# Altium schematic sheet PSU.SchDoc
size A4; Organization: Altium Limited; Address1: L3, 12a Rodborough Rd; Address2: Frenchs Forest; Address3: NSW; Address4: Australia 2086
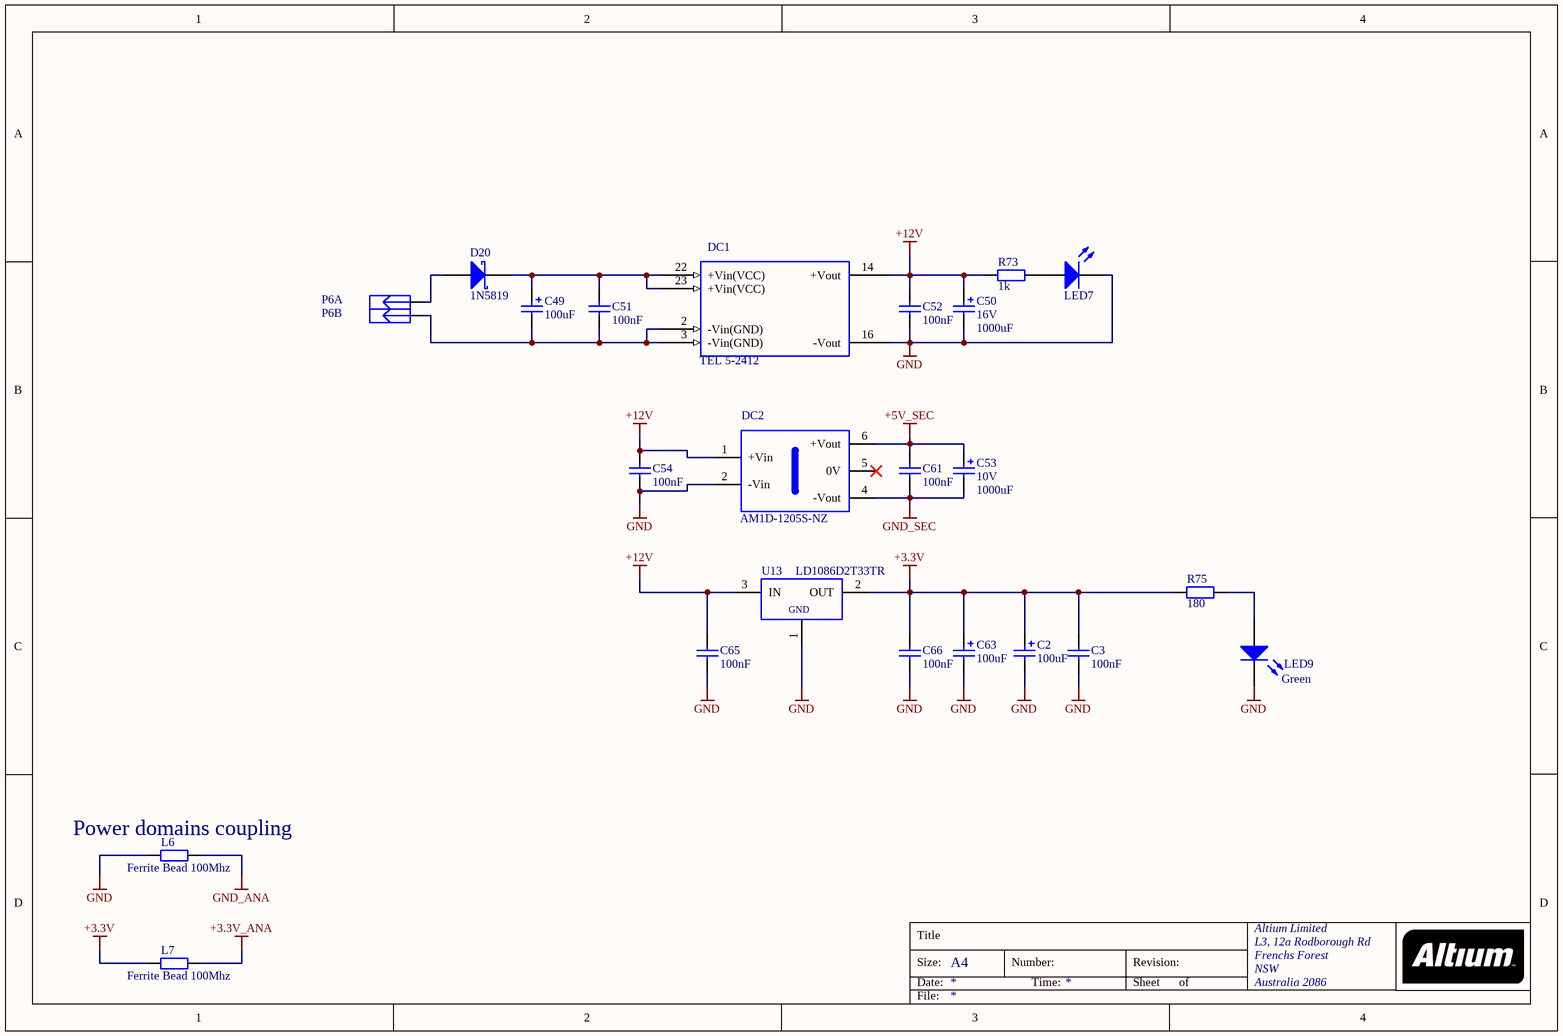
[diagram p0: PSU.SchDoc]

## Parts
C2  value 100uF  [CAPPR3.5-8x12]  (hidden comment: Cap)
C3  value 100nF  [1206_REFLOW]  (hidden comment: Cap 1206)
C49  value 100uF  [CAPPR3.5-8x12]  (hidden comment: Cap)
C50  value 1000uF  Voltage: 16V  [RA_8.0_RM3.5]  (hidden comment: Cap)
C51  value 100nF  [1206_REFLOW]  (hidden comment: Cap 1206)
C52  value 100nF  [1206_REFLOW]  (hidden comment: Cap 1206)
C53  value 1000uF  Voltage: 10V  [RA_8.0_RM3.5]  (hidden comment: Cap)
C54  value 100nF  [1206_REFLOW]  (hidden comment: Cap 1206)
C61  value 100nF  [1206_REFLOW]  (hidden comment: Cap 1206)
C63  value 100uF  [CAPPR3.5-8x12]  (hidden comment: Cap)
C65  value 100nF  [1206_REFLOW]  (hidden comment: Cap 1206)
C66  value 100nF  [1206_REFLOW]  (hidden comment: Cap 1206)
D20  1N5819  [DO-214_S1A(Primary)]
DC1  value TEL 5-2412  [DIP24_TRACO]  (hidden comment: EC3A21HM)
DC2  value AM1D-1205S-NZ  [-AM1D_AM1D-D(Primary)]  (hidden comment: AM1D-D)
L6  value Ferrite Bead 100Mhz  [1206_REFLOW]  (hidden comment: RES)
L7  value Ferrite Bead 100Mhz  [1206_REFLOW]  (hidden comment: RES)
LED7  LED  [LED_1206]  (value not drawn)
LED9  Green  [LED_1206]
P6  MSTBA 2,5/ 2-G-5,08  [STLZ950 2G-5.08-H]  (value not drawn)  (parts A,B of 2)
R73  value 1k  [1206_REFLOW]  (hidden comment: RES)
R75  value 180  [1206_REFLOW]  (hidden comment: RES)
U13  LD1086D2T33TR  [D2PAK]

## Nets
+3.3V: C2.1 C3.2 C63.1 C66.2 L7.1 R75.1 U13.2(OUT)
+3.3V_ANA: L7.2
+5V_SEC: C53.1 C61.2 DC2.6(+Vout)
+12V: C50.1 C52.2 C54.2 C65.2 DC1.14(+Vout) DC2.1(+Vin) R73.1 U13.3(IN)
GND: C2.2 C3.1 C50.2 C52.1 C54.1 C63.2 C65.1 C66.1 DC1.16(-Vout) DC2.2(-Vin) L6.1 LED7.K LED9.K U13.1(GND)
GND_ANA: L6.2
GND_SEC: C53.2 C61.1 DC2.4(-Vout)
NetC49_1: C49.1 C51.2 D20.K DC1.22(+Vin(VCC)) DC1.23(+Vin(VCC))
NetC49_2: C49.2 C51.1 DC1.2(-Vin(GND)) DC1.3(-Vin(GND)) P6.2(SIG)
NetD20_A: D20.A P6.1(SIG)
NetLED7_A: LED7.A R73.2
NetLED9_A: LED9.A R75.2

Not connected (* = marked no-connect by the designer): DC2 5(0V)*

## Notes on the sheet
- (near L6) Power domains coupling
- Title
- Size:
- Date:
- A4
- Number:
- Time:
- Revision:
- Sheet
- of
- File:

## Library data of the parts
C2 C49 C50 C53 C63 = Cap pol
  C50 C53: Manufacturer: *; Manufacturer Order Code: *; Supplier Order Code: *
DC1 = EC3A21HM: DC/DC CONVERTER, 3W 5V; Manufacturer: CINCON; Group: IC; Subgroup: Power Management; Subgroup1: DC-DC Converter; Supplier: Any; Order code: *; Package: DIL24; Mounting: TH; Mfrr. Part No.: EC3A21HM
DC2 = AM1D-D: Manufacturer 1: AIMTEC; Mfr 1 PN: AM1D-xxxxD; PN: 01060409-xxxx-xxxx; Group: Power Supply, Battery & Accessory; Detail: 1W DC/DC converters Dual output; Order code 1: {Order code 1}; Case: SIP7; Supplier 1: Comet; Price 1: {Price 1}
L6 L7 R73 R75 = RES 1
LED7 LED9 = LED: Value: TBD
P6 = MSTBA 2,5/ 2-G-5,08: Header, right angled, 12 A, 250 V, pitch 5.08 mm, No. of poles:2; Manufacturer: Phoenix; Mfrr. Part No.: 1757242; Group: Connector; Subgroup: Industrial; Value: MSTBA2,5/2; Supplier: Any; Mounting: TH; Package: TH; Order Code: *
U13 = LD1086-XX: STMICROELECTRONICS - LD1086D2T33TR - IC, V REG, LDO 3.3V, SMD; Value: LD1086D2T33TR
D20 = 1N5819: Value: 1N5819